# EAGLE design photoframe (EAGLE 9.2.1)
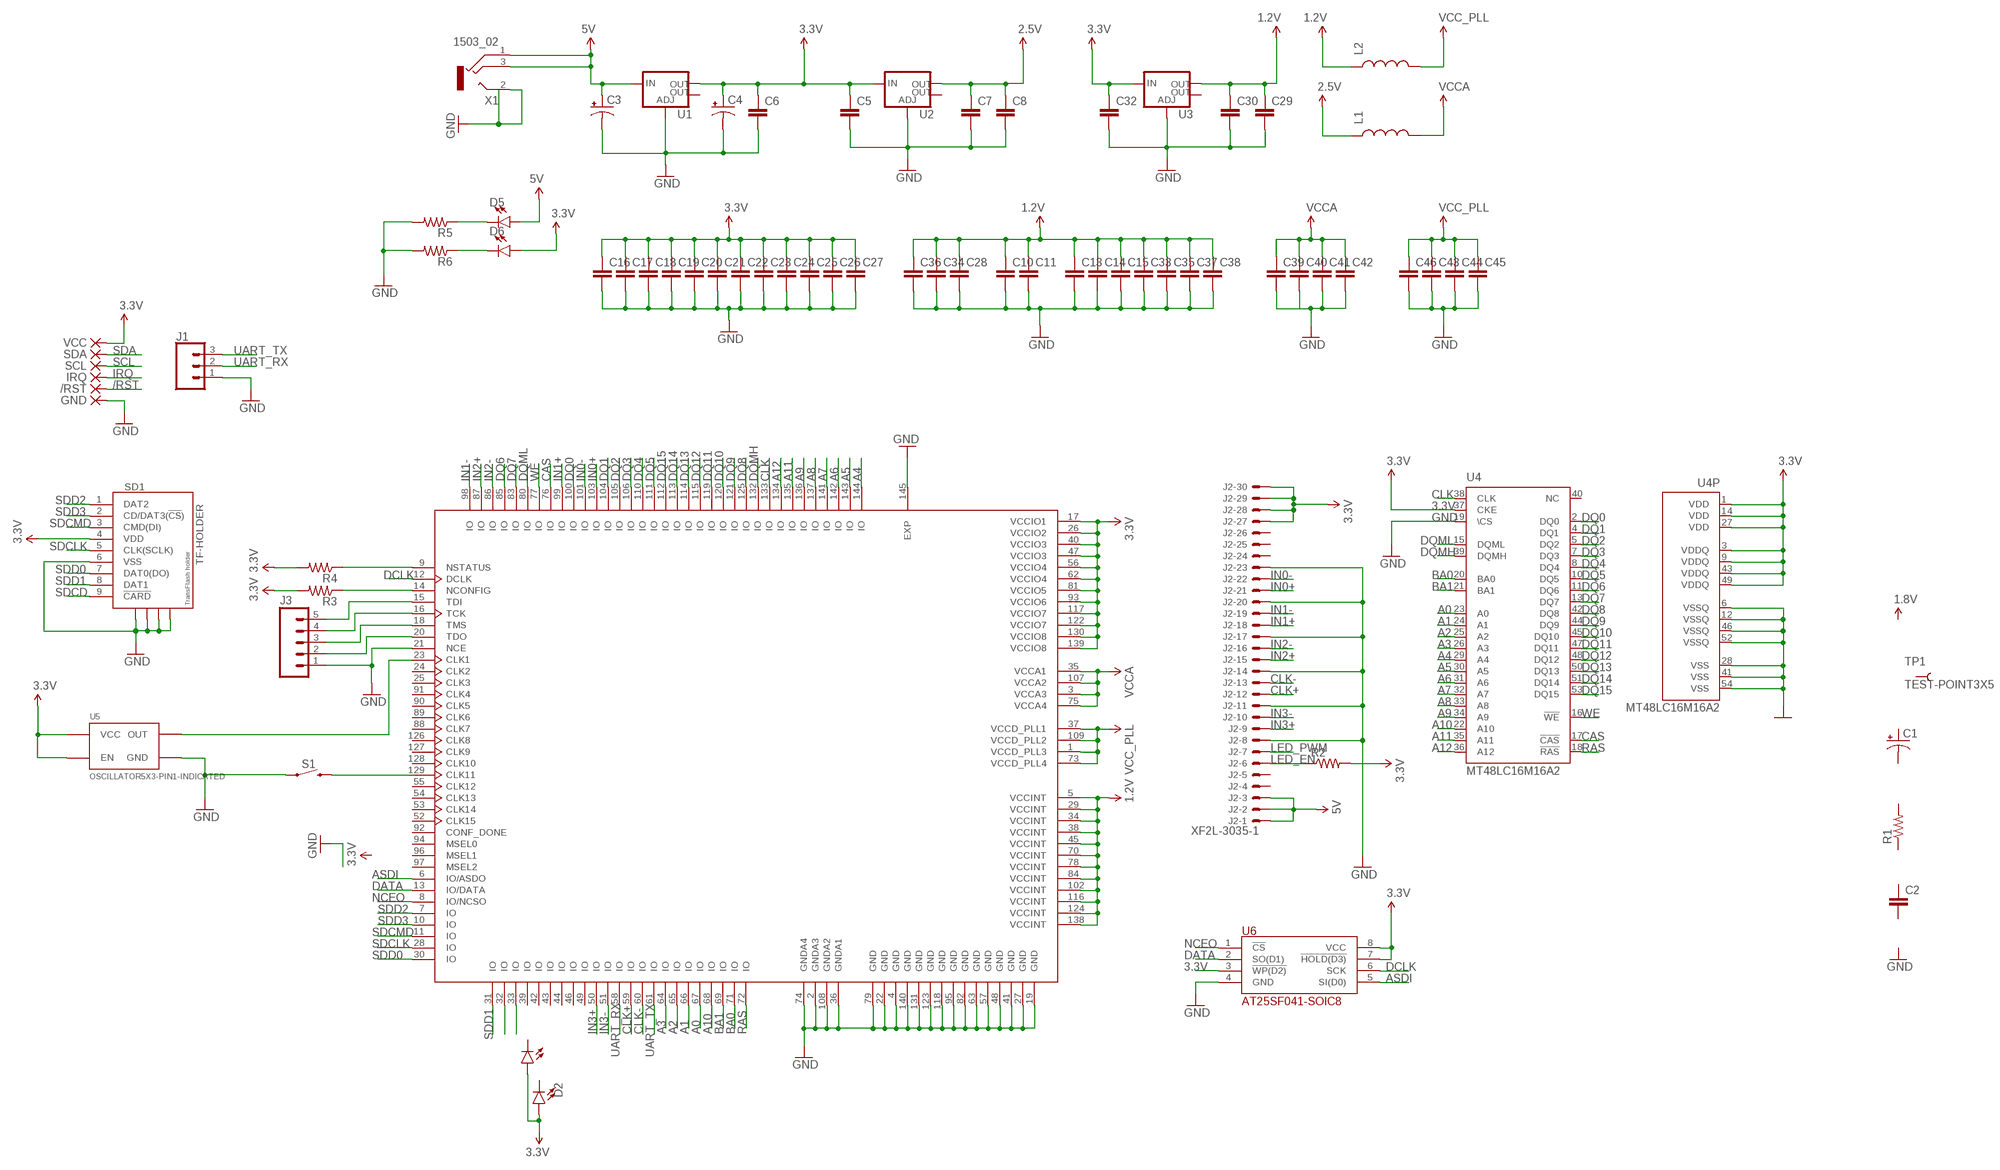
[diagram p0: schematic, sheet 1]

## Parts
/RST  PAD-SMD15R  [SMD15R]
C1  CAP_POL1206-KIT  [EIA3216-KIT]
C2  CAP0603-CAP  [0603-CAP]
C3  CAP_POL1206-KIT  [EIA3216-KIT]
C4  CAP_POL1206-KIT  [EIA3216-KIT]
C5  CAP1206  [1206]
C6  CAP0805  [0805]
C7  CAP1206  [1206]
C8  CAP0603-CAP  [0603-CAP]
C10  CAP0402-CAP  [0402-CAP]
C11  CAP0402-CAP  [0402-CAP]
C13  CAP0402-CAP  [0402-CAP]
C14  CAP0402-CAP  [0402-CAP]
C15  CAP0402-CAP  [0402-CAP]
C16  CAP0402-CAP  [0402-CAP]
C17  CAP0402-CAP  [0402-CAP]
C18  CAP0402-CAP  [0402-CAP]
C19  CAP0402-CAP  [0402-CAP]
C20  CAP0402-CAP  [0402-CAP]
C21  CAP0402-CAP  [0402-CAP]
C22  CAP0402-CAP  [0402-CAP]
C23  CAP0402-CAP  [0402-CAP]
C24  CAP0402-CAP  [0402-CAP]
C25  CAP0402-CAP  [0402-CAP]
C26  CAP0402-CAP  [0402-CAP]
C27  CAP0402-CAP  [0402-CAP]
C28  CAP0402-CAP  [0402-CAP]
C29  CAP0805  [0805]
C30  CAP1206  [1206]
C32  CAP1206  [1206]
C33  CAP0402-CAP  [0402-CAP]
C34  CAP0402-CAP  [0402-CAP]
C35  CAP0402-CAP  [0402-CAP]
C36  CAP0402-CAP  [0402-CAP]
C37  CAP0402-CAP  [0402-CAP]
C38  CAP0402-CAP  [0402-CAP]
C39  CAP0402-CAP  [0402-CAP]
C40  CAP0402-CAP  [0402-CAP]
C41  CAP0402-CAP  [0402-CAP]
C42  CAP0402-CAP  [0402-CAP]
C43  CAP0402-CAP  [0402-CAP]
C44  CAP0402-CAP  [0402-CAP]
C45  CAP0805  [0805]
C46  CAP0402-CAP  [0402-CAP]
D1  LED0603  [LED-0603]
D2  LED0603  [LED-0603]
D5  LED1206  [LED-1206]
D6  LED1206  [LED-1206]
GND  PAD-SMD14R  [SMD14R]
IRQ  PAD-SMD15R  [SMD15R]
J1  CONN_03LONGPADS  [1X03_LONGPADS]
J2  XF2L-3035-1  [XF2L-3035-1]
J3  M05PTH_LONGPADS  [1X05_LONGPADS]
L1  INDUCTOR0805-IND  [0805]
L2  INDUCTOR0805-IND  [0805]
R1  RESISTOR0603-RES  [0603-RES]
R2  RESISTOR0402-RES  [0402-RES]
R3  RESISTOR0402-RES  [0402-RES]
R4  RESISTOR0402-RES  [0402-RES]
R5  RESISTOR0603-RES  [0603-RES]
R6  RESISTOR0603-RES  [0603-RES]
S1  MOMENTARY-SWITCH-SPST-SMD-5.2-TALL-REDUNDANT  [TACTILE_SWITCH_SMD_5.2MM]
SCL  PAD-SMD15R  [SMD15R]
SD1  TF-HOLDER  [TF-PULL]
SDA  PAD-SMD15R  [SMD15R]
TP1  TEST-POINT3X5  [PAD.03X.05]
U0  EP4CE15E22  [QFP50P2200X2200X165-145N]
U1  V_REG_LM1117SOT223  [SOT223]
U2  V_REG_LM1117SOT223  [SOT223]
U3  V_REG_LM1117SOT223  [SOT223]
U4  MT48LC16M16A2  [TSOP54-400]
U5  OSCILLATOR5X3-PIN1-INDICATED  [CRYSTAL-OSC-SMD-5X3]
U6  AT25SF041-SOIC8  AT25SF041  [SO08]
VCC  PAD-SMD15R  [SMD15R]
X1  1503_02  [1503_02]

## Nets
1.0V: C10.1 C11.1 C13.1 C14.1 C15.1 C28.1 C29.1 C30.1 C33.1 C34.1 C35.1 C36.1 C37.1 C38.1 L2.1 U0.5(VCCINT) U0.29(VCCINT) U0.34(VCCINT) U0.38(VCCINT) U0.45(VCCINT) U0.70(VCCINT) U0.78(VCCINT) U0.84(VCCINT) U0.102(VCCINT) U0.116(VCCINT) U0.124(VCCINT) U0.138(VCCINT) U3.2(OUT) ; supply symbol labelled 1.2V
2.5V: C7.1 C8.1 L1.1 U2.2(OUT)
3.3V: C4.A(+) C5.1 C6.1 C16.1 C17.1 C18.1 C19.1 C20.1 C21.1 C22.1 C23.1 C24.1 C25.1 C26.1 C27.1 C32.1 D1.A D2.A D6.A J2.27 J2.28 J2.29 J2.30 R2.2 R3.2 R4.2 SD1.4(VDD) U0.17(VCCIO1) U0.26(VCCIO2) U0.40(VCCIO3) U0.47(VCCIO3) U0.56(VCCIO4) U0.62(VCCIO4) U0.81(VCCIO5) U0.93(VCCIO6) U0.117(VCCIO7) U0.122(VCCIO7) U0.130(VCCIO8) U0.139(VCCIO8) U1.2(OUT) U2.3(IN) U3.3(IN) U4.1(VDD) U4.3(VDDQ) U4.9(VDDQ) U4.14(VDD) U4.27(VDD) U4.37(CKE) U4.43(VDDQ) U4.49(VDDQ) U5.1(EN) U5.4(VCC) U6.3(!WP(D2)) U6.7(!HOLD(D3)) U6.8(VCC) VCC.PAD(P)
5V: C3.A(+) D5.A J2.1 J2.2 J2.3 U1.3(IN) X1.1 X1.3
/RST: /RST.PAD(P)
A0: U0.67(IO) U4.23(A0)
A1: U0.66(IO) U4.24(A1)
A2: U0.65(IO) U4.25(A2)
A3: U0.64(IO) U4.26(A3)
A4: U0.144(IO) U4.29(A4)
A5: U0.143(IO) U4.30(A5)
A6: U0.142(IO) U4.31(A6)
A7: U0.141(IO) U4.32(A7)
A8: U0.137(IO) U4.33(A8)
A9: U0.136(IO) U4.34(A9)
A10: U0.68(IO) U4.22(A10)
A11: U0.135(IO) U4.35(A11)
A12: U0.134(IO) U4.36(A12)
ASDI: U0.6(IO/ASDO) U6.5(SI(D0))
BA0: U0.71(IO) U4.20(BA0)
BA1: U0.69(IO) U4.21(BA1)
CAS: U0.76(IO) U4.17(!CAS)
CLK: U0.133(IO) U4.38(CLK)
CLK+: J2.12 U0.59(IO)
CLK-: J2.13 U0.60(IO)
DATA: U0.13(IO/DATA) U6.2(SO(D1))
DCLK: U0.12(DCLK) U6.6(SCK)
DQ0: U0.100(IO) U4.2(DQ0)
DQ1: U0.104(IO) U4.4(DQ1)
DQ2: U0.105(IO) U4.5(DQ2)
DQ3: U0.106(IO) U4.7(DQ3)
DQ4: U0.110(IO) U4.8(DQ4)
DQ5: U0.111(IO) U4.10(DQ5)
DQ6: U0.85(IO) U4.11(DQ6)
DQ7: U0.83(IO) U4.13(DQ7)
DQ8: U0.125(IO) U4.42(DQ8)
DQ9: U0.121(IO) U4.44(DQ9)
DQ10: U0.120(IO) U4.45(DQ10)
DQ11: U0.119(IO) U4.47(DQ11)
DQ12: U0.115(IO) U4.48(DQ12)
DQ13: U0.114(IO) U4.50(DQ13)
DQ14: U0.113(IO) U4.51(DQ14)
DQ15: U0.112(IO) U4.53(DQ15)
DQMH: U0.132(IO) U4.39(DQMH)
DQML: U0.80(IO) U4.15(DQML)
GND: C3.C(-) C4.C(-) C5.2 C6.2 C7.2 C8.2 C10.2 C11.2 C13.2 C14.2 C15.2 C16.2 C17.2 C18.2 C19.2 C20.2 C21.2 C22.2 C23.2 C24.2 C25.2 C26.2 C27.2 C28.2 C29.2 C30.2 C32.2 C33.2 C34.2 C35.2 C36.2 C37.2 C38.2 C39.2 C40.2 C41.2 C42.2 C43.2 C44.2 C45.2 C46.2 GND.PAD(P) J1.1 J2.8 J2.11 J2.14 J2.17 J2.20 J2.23 J3.1 R5.2 R6.2 S1.1 S1.2 SD1.6(VSS) SD1.S1 SD1.S2 SD1.S3 SD1.S4 U0.2(GNDA3) U0.4(GND) U0.19(GND) U0.21(NCE) U0.22(GND) U0.27(GND) U0.36(GNDA1) U0.41(GND) U0.48(GND) U0.57(GND) U0.63(GND) U0.74(GNDA4) U0.79(GND) U0.82(GND) U0.95(GND) U0.108(GNDA2) U0.118(GND) U0.123(GND) U0.131(GND) U0.140(GND) U0.145(EXP) U1.1(ADJ) U2.1(ADJ) U3.1(ADJ) U4.6(VSSQ) U4.12(VSSQ) U4.19(\CS) U4.28(VSS) U4.41(VSS) U4.46(VSSQ) U4.52(VSSQ) U4.54(VSS) U5.2(GND) U6.4(GND) X1.2 X1.2@2
IN0+: J2.21 U0.103(IO)
IN0-: J2.22 U0.101(IO)
IN1+: J2.18 U0.99(IO)
IN1-: J2.19 U0.98(IO)
IN2+: J2.15 U0.87(IO)
IN2-: J2.16 U0.86(IO)
IN3+: J2.9 U0.50(IO)
IN3-: J2.10 U0.51(IO)
IRQ: IRQ.PAD(P)
LED_EN: J2.6 R2.1
LED_PWM: J2.7
N$1: R4.1 U0.9(NSTATUS)
N$2: R3.1 U0.14(NCONFIG)
N$3: J3.2 U0.20(TDO)
N$4: J3.3 U0.18(TMS)
N$5: J3.4 U0.16(TCK)
N$6: U0.23(CLK1) U5.3(OUT)
N$7: J3.5 U0.15(TDI)
N$8: D5.C R5.1
N$9: D6.C R6.1
N$10: S1.3 S1.4 U0.129(CLK11)
N$16: U0.32(IO)
N$17: U0.33(IO)
NCEO: U0.8(IO/NCSO) U6.1(!CS)
RAS: U0.72(IO) U4.18(!RAS)
SCL: SCL.PAD(P)
SDA: SDA.PAD(P)
SDCD: SD1.9(!CARD)
SDCLK: SD1.5(CLK(SCLK)) U0.28(IO)
SDCMD: SD1.3(CMD(DI)) U0.11(IO)
SDD0: SD1.7(DAT0(DO)) U0.30(IO)
SDD1: SD1.8(DAT1) U0.31(IO)
SDD2: SD1.1(DAT2) U0.7(IO)
SDD3: SD1.2(CD/DAT3(!CS!)) U0.10(IO)
UART_RX: J1.2 U0.58(IO)
UART_TX: J1.3 U0.61(IO)
VCC_PLL: C43.1 C44.1 C45.1 C46.1 L2.2 U0.1(VCCD_PLL3) U0.37(VCCD_PLL1) U0.73(VCCD_PLL4) U0.109(VCCD_PLL2)
VCCA: C39.1 C40.1 C41.1 C42.1 L1.2 U0.3(VCCA3) U0.35(VCCA1) U0.75(VCCA4) U0.107(VCCA2)
WE: U0.77(IO) U4.16(!WE)
Unconnected: C1.A(+) C1.C(-) C2.1 C2.2 D1.C D2.C J2.4 J2.5 J2.24 J2.25 J2.26 R1.1 R1.2 TP1.P$1 U0.24(CLK2) U0.25(CLK3) U0.39(IO) U0.42(IO) U0.43(IO) U0.44(IO) U0.46(IO) U0.49(IO) U0.52(CLK15) U0.53(CLK14) U0.54(CLK13) U0.55(CLK12) U0.88(CLK7) U0.89(CLK6) U0.90(CLK5) U0.91(CLK4) U0.92(CONF_DONE) U0.94(MSEL0) U0.96(MSEL1) U0.97(MSEL2) U0.126(CLK8) U0.127(CLK9) U0.128(CLK10) U1.4(OUT) U2.4(OUT) U3.4(OUT) U4.40(NC)

## Library data of the parts
/RST GND IRQ SCL SDA VCC = dpads:PAD: WIRE PAD Standard US Drill Sizes and SMD pads
C1 C3 C4 = SparkFun-Passives:CAP_POL: Capacitor Polarized These are standard SMD and PTH capacitors. Normally 10uF, 47uF, and 100uF in electrolytic and tantalum varieties. Always verify the external diameter of the through hole cap, it varies with capacity, voltage, and manufacturer. The EIA devices should be standard.
C2 C5-C8 C10 C11 C13-C30 C32-C46 = SparkFun-Passives:CAP: Capacitor Standard 0603 ceramic capacitor, and 0.1" leaded capacitor.
D1 D2 D5 D6 = SparkFun-LED:LED: LED (Generic) Standard schematic elements and footprints for 5mm, 3mm, 1206, and 0603 sized LEDs. Generic LEDs with no color specified.
J1 = SparkFun-Connectors:CONN_03: Multi connection point. Often used as Generic Header-pin footprint for 0.1 inch spaced/style header connections On any of the 0.1 inch spaced packages, you can populate with these: Break Away Headers - Straight <https://www.sparkfun.com/products/116> (PRT-00116) Break Away Male Headers - Right Angle <https://www.sparkfun.com/products/553> (PRT-00553) Female Headers <https://www.sparkfun.com/products/115> (PRT-00115) Break Away Headers - Machine Pin <https://www.sparkfun.com/products/117> (PRT-00117) Break Away Female Headers - Swiss Machine Pin <https://www.sparkfun.com/products/743> (PRT-00743) Stackable Header - 3 Pin (Female, 0.1") <https://www.sparkfun.com/products/13875> (PRT-13875) For SCREWTERMINALS and SPRING TERMINALS visit here: Screw Terimnals on SparkFun.com <https://www.sparkfun.com/search/results?term=Screw+Terminals> (5mm/3.5mm/2.54mm spacing) This device is also useful as a general connection point to wire up your design to another part of your project. Our various solder wires solder well into these plated through hole pads. Hook-Up Wire - Assortment (Stranded, 22 AWG) <https://www.sparkfun.com/products/11375> (PRT-11375) Hook-Up Wire - Assortment (Solid Core, 22 AWG) <https://www.sparkfun.com/products/11367> (PRT-11367) View the entire wire category on our website here <https://www.sparkfun.com/categories/141> Special notes: Molex polarized connector foot print use with SKU : PRT-08232 with associated crimp pins and housings.
J2 = con-omron:XF2*-30?: OMRON FPC Connector Source : http://www.omron.com/ecb/products/pdf/fpc.pdf; MPN: XF2L-3035-1A; OC_FARNELL: 1430931; OC_NEWARK: 05M2008
J3 = SparkFun-Connectors:M05: Header 5 Standard 5-pin 0.1" header. Use with straight break away headers (SKU : PRT-00116), right angle break away headers (PRT-00553), swiss pins (PRT-00743), machine pins (PRT-00117), and female headers (PRT-00115). Molex polarized connector foot print use with SKU : PRT-08230 with associated crimp pins and housings.
L1 L2 = SparkFun-Passives:INDUCTOR: Inductors Basic Inductor/Choke - 0603 and 1206. Footprints are not proven and vary greatly between part numbers. INDUCTOR POWER 3.3UH 4.0A SMD 0.197" L x 0.197" W x 0.177" H (5.00mm x 5.00mm x 4.50mm); PROD_ID: NDUC-13076
R1-R6 = SparkFun-Passives:RESISTOR: Resistor Basic schematic elements and footprints for 0603, 1206, and PTH resistors.
S1 = SparkFun-Switches:MOMENTARY-SWITCH-SPST: Momentary Switch (Pushbutton) - SPST Normally-open (NO) SPST momentary switches (buttons, pushbuttons). Variants PTH-12MM - 12mm square, through-hole Momentary Pushbutton Switch - 12mm Square <https://www.sparkfun.com/products/9190> (COM-09190) PTH-6.0MM, PTH-6.0MM-KIT - 6.0mm square, through-hole Mini Pushbutton Switch <https://www.sparkfun.com/products/97> (COM-00097) KIT package intended for soldering kit's - only one side of pads' copper is exposed. PTH-RIGHT-ANGLE-KIT - Right-angle, through-hole Right Angle Tactile Button <https://www.sparkfun.com/products/10791> - Used on SparkFun BigTime Watch Kit <https://www.sparkfun.com/products/11734> SMD-12MM - 12mm square, surface-mount Tactile Button - SMD (12mm) <https://www.sparkfun.com/products/12993> (COM-12993) Used on SparkFun PicoBoard <https://www.sparkfun.com/products/11888> SMD-4.5MM - 4.5mm Square Trackball Switch Used on SparkFun Blackberry Trackballer Breakout <https://www.sparkfun.com/products/13169> SMD-4.6MMX2.8MM - 4.60mm x 2.80mm, surface mount Used on SparkFun SAMD21 Mini Breakout <https://www.sparkfun.com/products/13664> SMD-5.2MM, SMD-5.2-REDUNDANT - 5.2mm square, surface-mount Mini Pushbutton Switch - SMD <https://www.sparkfun.com/products/8720> (COM-08720) Used on Arduino Pro Mini <https://www.sparkfun.com/products/11114> REDUNDANT package connects both switch circuits together SMD-6.0X3.5MM - 6.0 x 3.5mm, surface mount Momentary Reset Switch SMD <https://www.sparkfun.com/products/8229> (COM-08229) SMD-6.2MM-TALL - 6.2mm square, surface mount Tactile Button - SMD (6mm) <https://www.sparkfun.com/products/12992> Used on SparkFun Digital Sandbox <https://www.sparkfun.com/products/12651> SMD-RIGHT-ANGLE - Right-angle, surface mount Used on SparkFun Block for Intel® Edison - Arduino <https://www.sparkfun.com/products/13036>; PROD_ID: SWCH-14139
SD1 = sd-mmc:TF-HOLDER: TF / Micro SD socket is PUSH-PUSH type, the card can be pushed into and auto locked and pushed out by simply press the card. Surface Mounting type.
TP1 = SparkFun-Passives:TEST-POINT: Bare copper test points for troubleshooting or ICT
U0 = EP4CE6E22C8N:EP4CE15E22
U1-U3 = SparkFun-PowerIC:V_REG_LM1117: Voltage Regulator LM1117 Standard adjustable voltage regulator but in SMD form. Spark Fun Electronics SKU : COM-00595; PROD_ID: VREG-08170
U4 = memory-micron:MT48LC16M16A2: 256Mb: x16 SDRAM MT48LC16M16A2 - 4 Meg x 16 x 4 banks Source: http://download.micron.com/pdf/datasheets/dram/sdram/256MSDRAM.pdf; OC_FARNELL: unknown; OC_NEWARK: unknown
U5 = SparkFun-FreqCtrl:OSCILLATOR: Generic 5x3 and 7x5 oscillators
U6 = SparkFun-DigitalIC:AT25SF041: SPI Serial flash memory with dual/quad-IO support; PROD_ID: IC-12455
X1 = con-lumberg:1503_02: Jack connectors according to JISC 6560, 3.5 mm Klinkeneinbaukupplung nach JISC 6560, 3,5 mm, 3-polig/stereo, abgewinkelte Ausführung, Surface-Mount-Technik (SMT) Source: http://www.lumberg.com/Produkte/PDFs/1503_02.pdf; OC_FARNELL: 1216979; OC_NEWARK: unknown

## Board
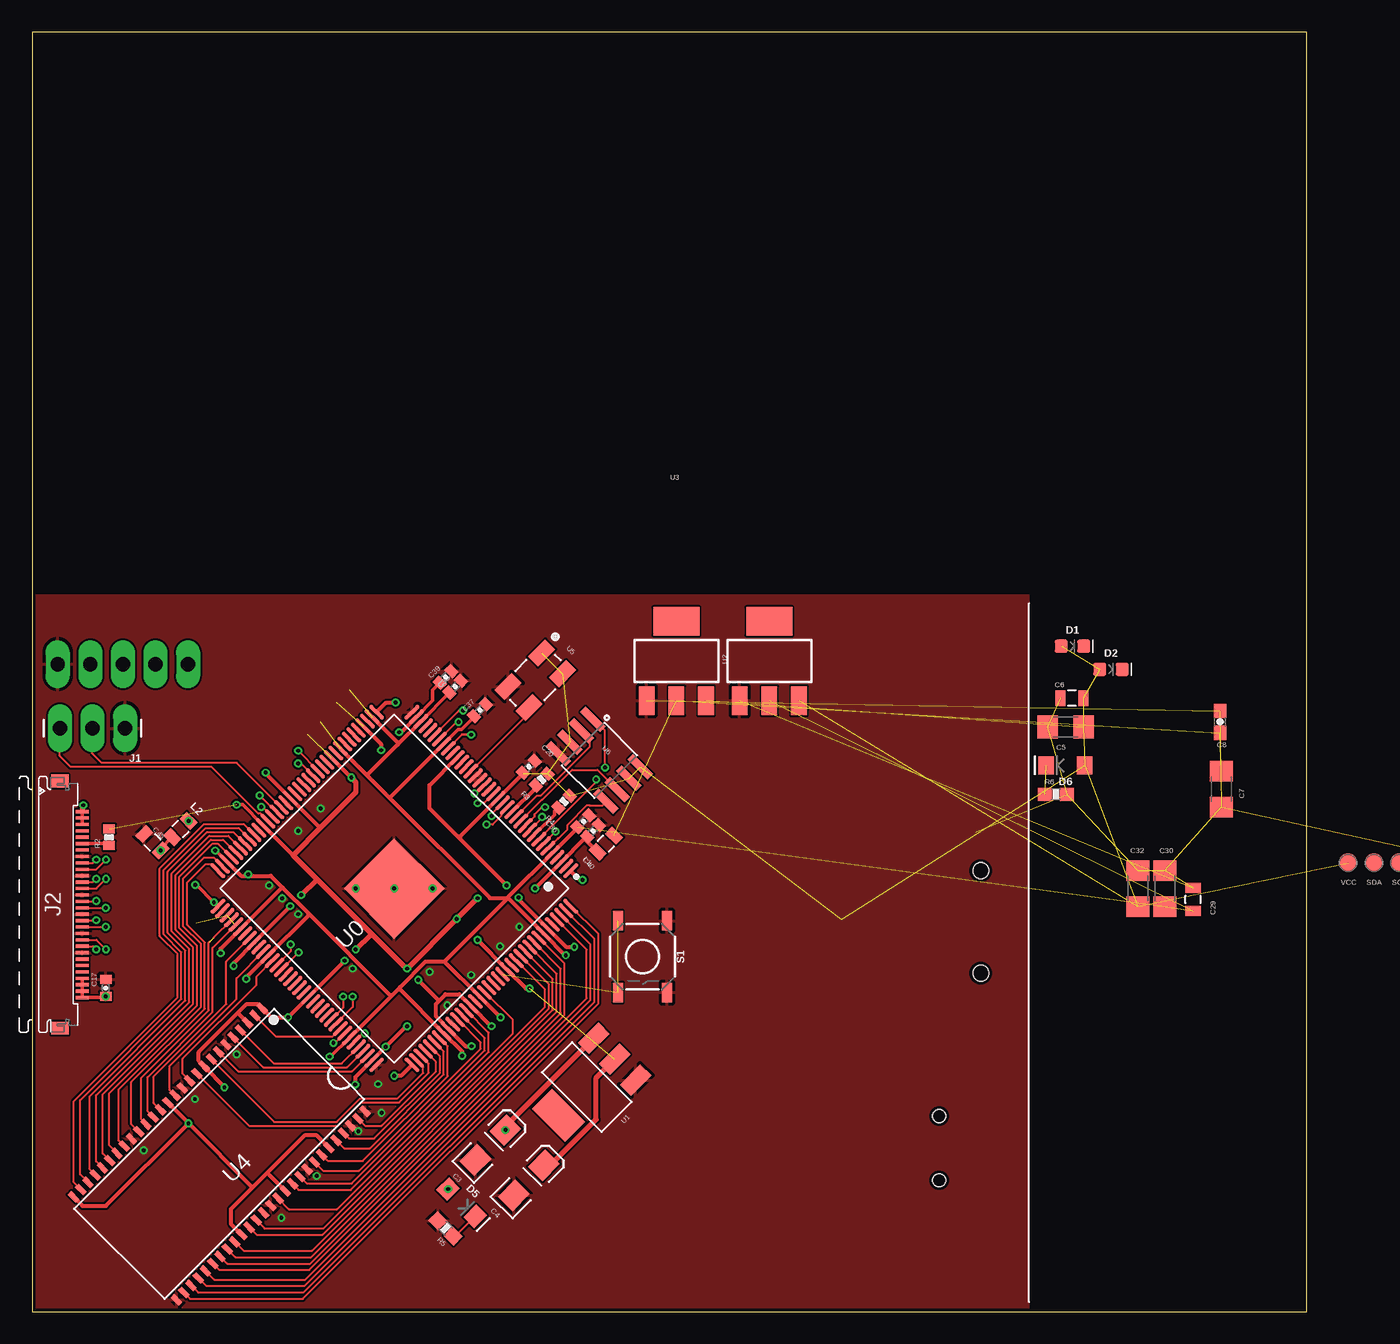
[diagram p1: board, top side]
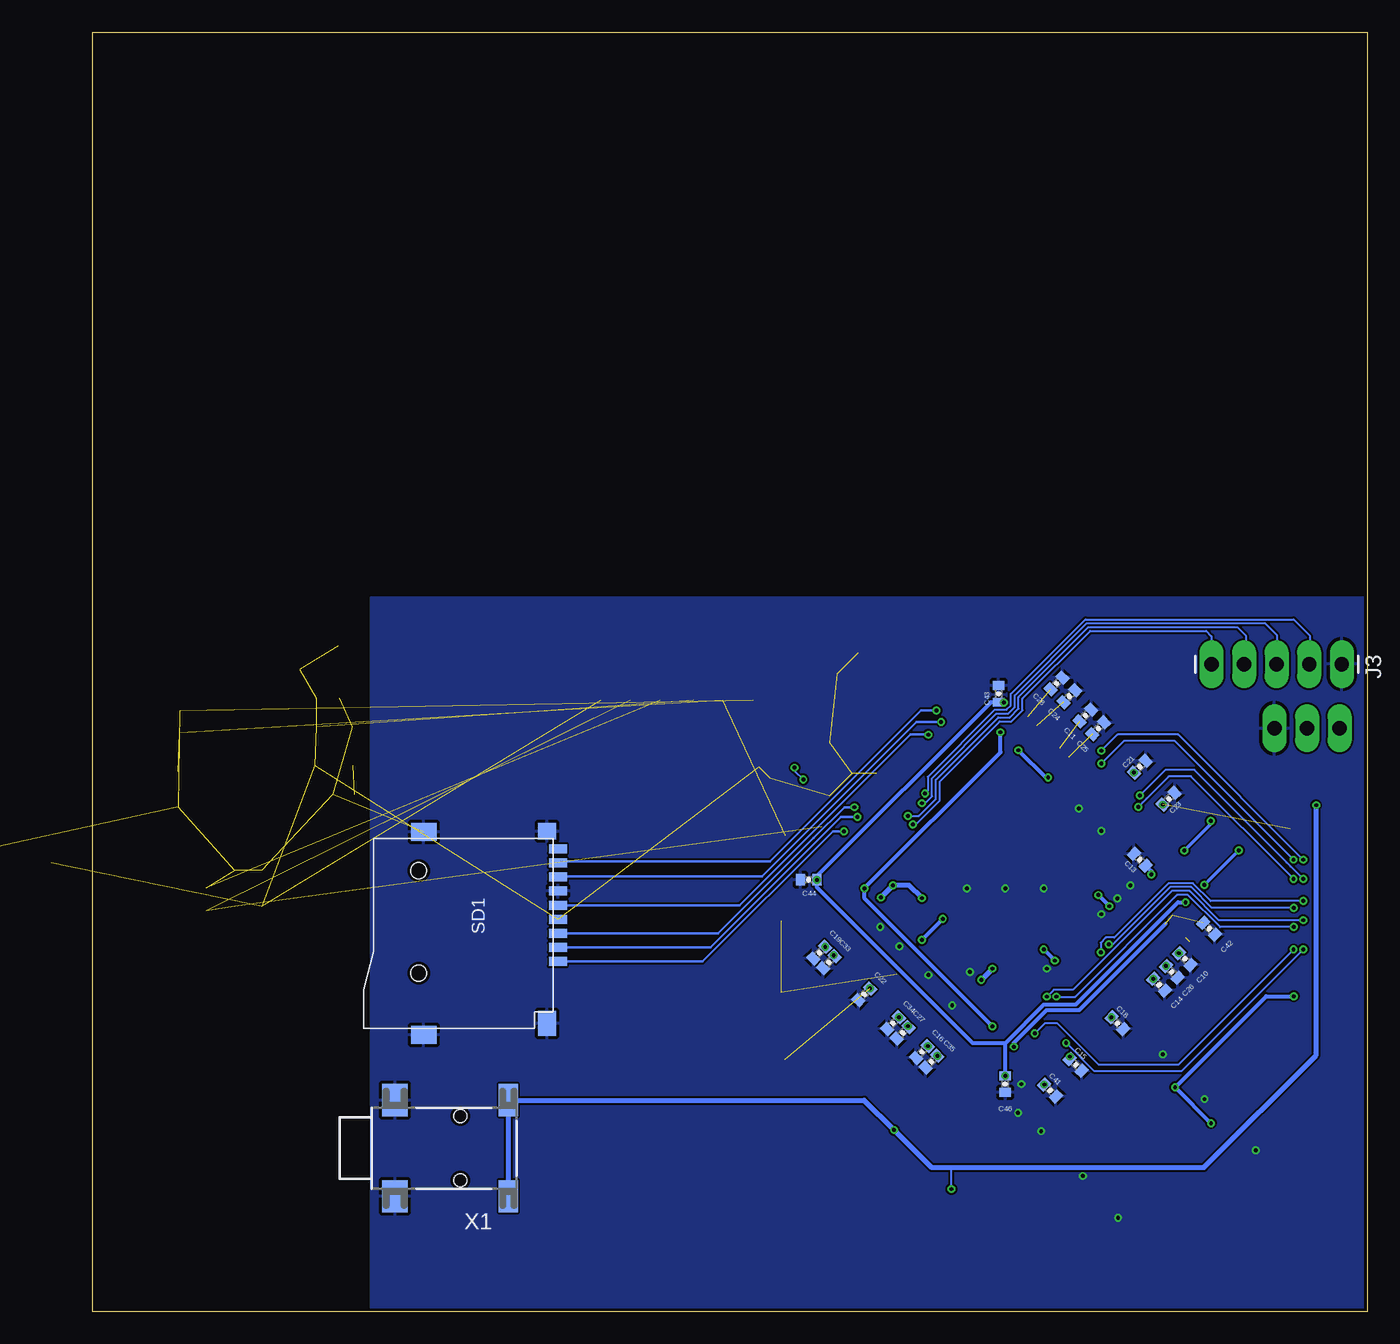
[diagram p2: board, bottom side, seen from below]

Size 99.4 x 99.8 mm. Coordinates in mm from the lower left corner, seen from the top.
Outline: 0,0 99.4,0 99.4,99.8 0,99.8 0,0
Copper layers (1*16): Top 0.035mm / dielectric 1.5mm / Bottom 0.035mm
Design rules "SeeedStudio_2layer_DRU_no_angle_20140221": minimum track width 6mil, minimum drill 12mil, track to track 6mil, track to pad 6mil, pad to pad 6mil, via to via 6mil, smd to smd 0mil, copper to edge 10mil, drill to drill 10mil, minimum pad ring 10mil, minimum via ring 6mil, stop-mask expansion 2mil, vias tented up to drill 100mil, thermal gap 10mil

### Footprints (pad centres in the part's own frame; a part is rotated, then mirrored left to right if it is on the bottom)
SMD15R = smd 1.5 x 1.5: PAD 0,0
EIA3216-KIT = smd 1.9 x 1.6: A 1.65,0; C -1.65,0
0603-CAP = smd 1.1 x 1: 1 -0.85,0; 2 0.85,0
1206 = smd 1.6 x 1.8: 1 -1.4,0; 2 1.4,0
0805 = smd 0.8 x 1.2: 1 -0.9,0; 2 0.9,0
0402-CAP = smd 0.7 x 0.9: 1 -0.65,0; 2 0.65,0
LED-0603 = smd 1 x 1: A -0.877,0; C 0.877,0
LED-1206 = smd 1.2 x 1.4: A -1.5,0; C 1.5,0
SMD14R = smd 1.4 x 1.4: PAD 0,0
1X03_LONGPADS = drill 1.118 pad 1.88 long: 1 0,0; 2 2.54,0; 3 5.08,0
XF2L-3035-1 = smd 1 x 0.25: 1 1.905,7.25; 2 1.905,6.75; 3 1.905,6.25; 4 1.905,5.75; 5 1.905,5.25; 6 1.905,4.75; 7 1.905,4.25; 8 1.905,3.75; 9 1.905,3.25; 10 1.905,2.75; 11 1.905,2.25; 12 1.905,1.75; 13 1.905,1.25; 14 1.905,0.75; 15 1.905,0.25; 16 1.905,-0.25; 17 1.905,-0.75; 18 1.905,-1.25; 19 1.905,-1.75; 20 1.905,-2.25; 21 1.905,-2.75; 22 1.905,-3.25; 23 1.905,-3.75; 24 1.905,-4.25; 25 1.905,-4.75; 26 1.905,-5.25; 27 1.905,-5.75; 28 1.905,-6.25; 29 1.905,-6.75; 30 1.905,-7.25 | smd 1.34 x 1: M1 0.18,9.637; M2 0.18,-9.637
1X05_LONGPADS = drill 1.118 pad 1.88 long: 1 0,0; 2 2.54,0; 3 5.08,0; 4 7.62,0; 5 10.16,0
0603-RES = smd 1.1 x 1: 1 -0.85,0; 2 0.85,0
0402-RES = smd 0.7 x 0.9: 1 -0.65,0; 2 0.65,0
TACTILE_SWITCH_SMD_5.2MM = smd 1.524 x 0.762: 1 -2.794,1.905; 2 2.794,1.905; 3 -2.794,-1.905; 4 2.794,-1.905
TF-PULL = smd 0.7 x 1.4: 1 -2.2,-7.62; 2 -1.1,-7.62; 3 0,-7.62; 4 1.1,-7.62; 5 2.2,-7.62; 6 3.3,-7.62; 7 4.4,-7.62; 8 5.5,-7.62; 9 6.6,-7.62 | smd 1.4 x 2: S1 -7.9,2.85; S2 7.9,2.85 | smd 1.28 x 1.4: S3 7.96,-6.75 | smd 1.95 x 1.4: S4 -7.025,-6.75 | hole 1.25: -3.1,3.25; 4.9,3.25
PAD.03X.05 = smd 1.27 x 1.27: P$1 0,0
QFP50P2200X2200X165-145N = smd 1.5 x 0.3: 1 -10.7,8.75; 2 -10.7,8.25; 3 -10.7,7.75; 4 -10.7,7.25; 5 -10.7,6.75; 6 -10.7,6.25; 7 -10.7,5.75; 8 -10.7,5.25; 9 -10.7,4.75; 10 -10.7,4.25; 11 -10.7,3.75; 12 -10.7,3.25; 13 -10.7,2.75; 14 -10.7,2.25; 15 -10.7,1.75; 16 -10.7,1.25; 17 -10.7,0.75; 18 -10.7,0.25; 19 -10.7,-0.25; 20 -10.7,-0.75; 21 -10.7,-1.25; 22 -10.7,-1.75; 23 -10.7,-2.25; 24 -10.7,-2.75; 25 -10.7,-3.25; 26 -10.7,-3.75; 27 -10.7,-4.25; 28 -10.7,-4.75; 29 -10.7,-5.25; 30 -10.7,-5.75; 31 -10.7,-6.25; 32 -10.7,-6.75; 33 -10.7,-7.25; 34 -10.7,-7.75; 35 -10.7,-8.25; 36 -10.7,-8.75; 73 10.7,-8.75; 74 10.7,-8.25; 75 10.7,-7.75; 76 10.7,-7.25; 77 10.7,-6.75; 78 10.7,-6.25; 79 10.7,-5.75; 80 10.7,-5.25; 81 10.7,-4.75; 82 10.7,-4.25; 83 10.7,-3.75; 84 10.7,-3.25; 85 10.7,-2.75; 86 10.7,-2.25; 87 10.7,-1.75; 88 10.7,-1.25; 89 10.7,-0.75; 90 10.7,-0.25; 91 10.7,0.25; 92 10.7,0.75; 93 10.7,1.25; 94 10.7,1.75; 95 10.7,2.25; 96 10.7,2.75; 97 10.7,3.25; 98 10.7,3.75; 99 10.7,4.25; 100 10.7,4.75; 101 10.7,5.25; 102 10.7,5.75; 103 10.7,6.25; 104 10.7,6.75; 105 10.7,7.25; 106 10.7,7.75; 107 10.7,8.25; 108 10.7,8.75 | smd 0.3 x 1.5: 37 -8.75,-10.7; 38 -8.25,-10.7; 39 -7.75,-10.7; 40 -7.25,-10.7; 41 -6.75,-10.7; 42 -6.25,-10.7; 43 -5.75,-10.7; 44 -5.25,-10.7; 45 -4.75,-10.7; 46 -4.25,-10.7; 47 -3.75,-10.7; 48 -3.25,-10.7; 49 -2.75,-10.7; 50 -2.25,-10.7; 51 -1.75,-10.7; 52 -1.25,-10.7; 53 -0.75,-10.7; 54 -0.25,-10.7; 55 0.25,-10.7; 56 0.75,-10.7; 57 1.25,-10.7; 58 1.75,-10.7; 59 2.25,-10.7; 60 2.75,-10.7; 61 3.25,-10.7; 62 3.75,-10.7; 63 4.25,-10.7; 64 4.75,-10.7; 65 5.25,-10.7; 66 5.75,-10.7; 67 6.25,-10.7; 68 6.75,-10.7; 69 7.25,-10.7; 70 7.75,-10.7; 71 8.25,-10.7; 72 8.75,-10.7; 109 8.75,10.7; 110 8.25,10.7; 111 7.75,10.7; 112 7.25,10.7; 113 6.75,10.7; 114 6.25,10.7; 115 5.75,10.7; 116 5.25,10.7; 117 4.75,10.7; 118 4.25,10.7; 119 3.75,10.7; 120 3.25,10.7; 121 2.75,10.7; 122 2.25,10.7; 123 1.75,10.7; 124 1.25,10.7; 125 0.75,10.7; 126 0.25,10.7; 127 -0.25,10.7; 128 -0.75,10.7; 129 -1.25,10.7; 130 -1.75,10.7; 131 -2.25,10.7; 132 -2.75,10.7; 133 -3.25,10.7; 134 -3.75,10.7; 135 -4.25,10.7; 136 -4.75,10.7; 137 -5.25,10.7; 138 -5.75,10.7; 139 -6.25,10.7; 140 -6.75,10.7; 141 -7.25,10.7; 142 -7.75,10.7; 143 -8.25,10.7; 144 -8.75,10.7 | smd 5.55 x 5.55: 145 0,0
SOT223 = smd 1.219 x 2.235: 1 -2.311,-3.099; 2 0,-3.099; 3 2.311,-3.099 | smd 3.6 x 2.2: 4 0,3.099
TSOP54-400 = smd 0.4 x 0.9: 1 -10.4,-5.68; 2 -9.6,-5.68; 3 -8.8,-5.68; 4 -8,-5.68; 5 -7.2,-5.68; 6 -6.4,-5.68; 7 -5.6,-5.68; 8 -4.8,-5.68; 9 -4,-5.68; 10 -3.2,-5.68; 11 -2.4,-5.68; 12 -1.6,-5.68; 13 -0.8,-5.68; 14 0,-5.68; 15 0.8,-5.68; 16 1.6,-5.68; 17 2.4,-5.68; 18 3.2,-5.68; 19 4,-5.68; 20 4.8,-5.68; 21 5.6,-5.68; 22 6.4,-5.68; 23 7.2,-5.68; 24 8,-5.68; 25 8.8,-5.68; 26 9.6,-5.68; 27 10.4,-5.68; 28 10.4,5.68; 29 9.6,5.68; 30 8.8,5.68; 31 8,5.68; 32 7.2,5.68; 33 6.4,5.68; 34 5.6,5.68; 35 4.8,5.68; 36 4,5.68; 37 3.2,5.68; 38 2.4,5.68; 39 1.6,5.68; 40 0.8,5.68; 41 0,5.68; 42 -0.8,5.68; 43 -1.6,5.68; 44 -2.4,5.68; 45 -3.2,5.68; 46 -4,5.68; 47 -4.8,5.68; 48 -5.6,5.68; 49 -6.4,5.68; 50 -7.2,5.68; 51 -8,5.68; 52 -8.8,5.68; 53 -9.6,5.68; 54 -10.4,5.68
CRYSTAL-OSC-SMD-5X3 = smd 1.9 x 1.1: 1 -1.85,-1.15; 2 1.85,-1.15; 3 1.85,1.15; 4 -1.85,1.15
SO08 = smd 0.61 x 2.21: 1 -1.905,-2.616; 2 -0.635,-2.616; 3 0.635,-2.616; 4 1.905,-2.616; 5 1.905,2.616; 6 0.635,2.616; 7 -0.635,2.616; 8 -1.905,2.616
1503_02 = smd 2.5 x 1.5: 1 -3.75,-10.75; 3 3.75,-10.75 | smd 2.5 x 2: 2 -3.75,-1.9; 2@2 3.75,-1.9 | hole 1: -2.5,-7; 2.5,-7

### Placement (x,y rotation side)
/RST  108.65,35 0 top  (outside the outline)
C1  -27.94,58.42 0 top  (outside the outline)
C2  -63.5,58.42 0 top  (outside the outline)
C3  35.75,13 45 top
C4  38.75,10.25 45 top
C5  80.6,45.6 180 top
C6  81.1,47.85 180 top
C7  92.75,40.75 270 top
C8  92.65,46 90 top
C10  14.25,27.5 315 bottom
C11  22,46.5 45 bottom
C13  17.75,35.25 135 bottom
C14  16.25,25.5 315 bottom
C15  22.75,19.25 315 bottom
C16  34.75,20.25 225 bottom
C17  5.75,25.25 90 top
C18  19.5,22.5 315 bottom
C19  42.75,28 225 bottom
C20  38.75,42.5 45 top
C21  17.75,42.5 45 bottom
C22  39.25,24.75 225 bottom
C23  15.5,40 45 bottom
C24  23.25,48 45 bottom
C25  21,45.5 45 bottom
C26  15.25,26.5 315 bottom
C27  36.25,21.75 225 bottom
C28  24.25,49 45 bottom
C29  90.55,32.15 90 top
C30  88.35,33 90 top
C32  86.25,33 90 top
C33  42,27.25 225 bottom
C34  37,22.5 225 bottom
C35  34,19.5 225 bottom
C36  43,38.25 45 top
C37  34.93,46.91 45 top
C38  33,48.75 45 top
C39  32.25,49.5 45 top
C40  43.75,37.5 45 top
C41  24.75,17.25 315 bottom
C42  12.35,29.87 315 bottom
C43  28.77,48.18 90 bottom
C44  43.58,33.68 180 bottom
C45  9.39,36.61 135 top
C46  28.25,17.75 270 bottom
D1  81.15,51.9 0 top
D2  84.15,50.1 0 top
D5  33.5,8.5 315 top
D6  80.6,42.6 180 top
GND  112.65,35 0 top  (outside the outline)
IRQ  110.65,35 0 top  (outside the outline)
J1  7.25,45.5 180 top
J2  2,31.75 0 top
J3  2,50.5 180 bottom
L1  44.75,36.5 225 top
L2  11.57,37.64 225 top
R1  -30.48,63.5 0 top  (outside the outline)
R2  6,37 90 top
R3  39.75,41.5 45 top
R4  41.49,39.78 45 top
R5  32.25,6.5 135 top
R6  79.85,40.35 0 top
S1  47.61,27.69 270 top
SCL  106.65,35 0 top  (outside the outline)
SD1  70.75,29.5 90 bottom
SDA  104.65,35 0 top  (outside the outline)
TP1  -36.83,68.58 0 top  (outside the outline)
U0  28.25,33 225 top
U1  43.25,17.5 135 top
U2  50.25,50.75 0 top
U3  57.5,50.75 0 top
U4  14.6,12.29 225 top
U5  39.25,49.25 225 top
U6  44.25,43 225 top
VCC  102.65,35 0 top  (outside the outline)
X1  77.75,12.75 90 bottom

### Tracks (layer width: path | path; a pad name or v marks a point on that pad's centre or on a via)
1.0V  (via drill 0.3 pad 0.6)  (5 unrouted)
  Top 0.254: U0.102 23.27,19.89 v23.21,19.89 | U0.70 14.33,35.96 v14.28,35.96 | U0.34 32.54,48.25 C38.1 | 42.54,37.74 C36.1 | U0.29 33.24,45.42 33.49,45.42 34.47,46.39 C37.1
  Top 0.305: U0.45 26.11,41.86 | 26.11,41.86 27.86,40.11 | 27.86,40.11 35.72,32.25 37.13,32.25 | 37.13,32.25 U0.138 41.58,27.8 v41.63,27.8 | 37.13,32.25 37.13,32.34 U0.5 42.54,37.74 | U0.29 27.93,40.11 27.86,40.11 | U0.34 28.52,44.23 | 28.52,44.23 26.15,41.86 26.11,41.86 | U0.38 28.52,44.4 28.52,44.23 | 37.13,32.25 32.19,27.31 | 32.19,27.31 32.19,27.29 U0.124 36.52,22.96 C34.1 | U0.70 16.29,34 16.75,34 | 16.75,34 18.62,34 19.56,33.06 | U0.102 28.07,24.68 | 28.07,24.68 28.69,25.31 | 28.69,25.31 30.69,27.31 32.19,27.31 | 28.07,24.68 27.93,24.68 21.56,31.06 | 19.56,33.06 21.56,31.06 | 28.69,25.31 28.69,25.14 U0.116 33.54,20.29 C35.1 | 19.56,33.06 19.47,33.06 U0.78 14.71,28.3 C10.1 | 21.56,31.06 21.56,30.91 U0.84 16.71,26.06 C14.1 | v16.84,34.09 16.75,34
  Bottom 0.254: v14.28,35.96 12.21,38.03 L2.1
  Bottom 0.305: C13.1 16.84,34.34 v16.84,34.09 | C34.1 | v41.63,27.8 C33.1 | v23.21,19.89 C15.1
  other vias: 36.54,22.96 33.54,19.96 16.71,25.96 14.71,27.96 12.21,38.28
2.5V  (3 unrouted)
3.3V  (via drill 0.3 pad 0.6)  (21 unrouted)
  Top 0.254: C17.1 5.65,24.5 J2.30 J2.29 J2.28 J2.27 | U0.62 16.41,39.54 C23.1 | 38.29,41.98 C20.1
  Top 0.305: U0.62 20.35,35.6 | 29.2,26.75 v29.25,26.75 | U0.47 v24.9,41.65 | 20.35,35.6 | 22.5,37.75 22.44,37.75 U0.56 18.21,41.98 C21.1 | v37.95,32.29 37.95,32.14 U0.139 41.63,28.46 C19.1 | v37,33.25 33.38,36.88 | 33.38,36.88 31,39.25 31,41.05 U0.26 | 33.38,36.88 33.38,37.06 U0.17 38.29,41.98 | U0.40 27.21,44.29 v27.21,43.79 | 31.75,24.25 31.5,24 31.5,23.03 U0.117 33.82,20.71 C16.1 | 31.75,24.25 32.25,24.75 33.32,24.75 U0.122 35.8,22.27 v35.85,22.27 | v30.12,25.88 31.75,24.25 | v20.13,31.63 20.13,31.6 U0.81 15.71,27.18 C26.1 | v24.38,27.38 24.38,27.36 U0.93 19.98,22.96 C18.1 18.64,22.96 U4.1 17.6,24 16.75,24 16,23.25 | C22.1 38.52,25.21 U0.130 34.75,28.98 v34.75,29 | 16,23.25 13,20.25 13,19.55 U4.9 15,17.55 v15,17.5 | U4.3 16.09,23.25 16,23.25 | U4.49 22.2,13.75 21.25,13.75 18.38,10.88 | U4.37 15.5,6.87 15.5,8 17.25,9.75 | 18.38,10.88 17.25,9.75 | U4.43 18.38,10.78 18.38,10.88 | U4.14 v12.2,14.7 | v12.2,14.7 17.15,9.75 17.25,9.75 | U4.27 3.94,8.25 5.75,8.25 v12.2,14.7 | 22.22,33.72 | 26.47,29.47
  Top 0.406: 22.22,33.72 20.35,35.6 22.5,37.75 25.25,40.5 25.25,41.3 v24.9,41.65 | 22.22,33.72 26.47,29.47 | 26.47,29.47 29.2,26.75 | v20.99,32.49 22.22,33.72 | v25.25,28.25 26.47,29.47 | v29.25,26.75 v33.12,30.62 v34.75,32.25 | C4.A 40.42,11.42 44,15 44,18.25 U1.2 | U1.2
  Bottom 0.305: v37,33.24 v37,33.25 | v27.21,43.79 25.08,41.65 v24.9,41.65 | v20.13,31.63 v20.99,32.49 | v24.38,27.38 v25.25,28.25 | v35.85,22.27 C27.1 | C19.1 | v12.2,14.7 v15,17.5 7.9,24.6 C17.1 | v34.75,29 v33.12,30.62
  Bottom 0.406: v29.25,26.75 v30.12,25.88 | v37.95,32.29 v37,33.24 35.74,33.24 v34.75,32.25
  other vias: 38.79,25.21 42.29,28.46 34.29,20.71 19.96,22.96 15.71,26.96 5.75,24.6 15.96,39.54 18.21,42.04
5V  (via drill 0.3 pad 0.6)
  Top 0.254: J2.1 J2.2 J2.3
  Top 0.406: C3.A 37.25,14.5 37.25,14.75 43.81,21.31 U1.3 | v4,39.5 3.9,39.41 J2.1
  Bottom 0.152: 32.5,11.25 32.5,9.62 D5.A
  Bottom 0.406: v4,39.5 4,20 12.75,11.25 32.5,11.25 34,11.25 C3.A 39.25,16.5 X1.3 X1.1
  other vias: 36.92,14.17 32.44,9.56
A0
  Top 0.152: U4.23 5,11.71 5,16.88 12.26,24.14 12.26,28.29 10.88,29.66 10.88,34.18 13.82,37.11 15.3,37.11 U0.67
A1
  Top 0.152: U4.24 4.5,11.08 4.5,16.81 11.95,24.26 11.95,28.16 10.58,29.53 10.58,34.33 13.66,37.41 15.7,37.41 U0.66
A2
  Top 0.152: U4.25 3.75,10.7 3.75,16.49 11.65,24.39 11.65,28.04 10.27,29.41 10.27,34.45 13.54,37.72 16.11,37.72 U0.65
A3
  Top 0.152: U4.26 3.25,10.07 3.25,16.42 11.34,24.52 11.34,27.91 9.97,29.28 9.97,34.58 13.41,38.02 16.51,38.02 U0.64
A4
  Top 0.152: U4.29 12.32,1 21.11,1 44.16,24.05 44.16,29.46 U0.144
A5
  Top 0.152: U4.30 12.95,1.5 21.18,1.5 43.86,24.18 43.86,29.06 U0.143
A6
  Top 0.152: U4.31 13.58,2 21.25,2 43.55,24.3 43.55,28.66 U0.142
A7
  Top 0.152: U4.32 14.21,2.5 21.31,2.5 43.25,24.44 43.25,28.25 U0.141
A8
  Top 0.152: U4.33 14.6,3.25 21.63,3.25 41.52,23.14 41.52,27.15 U0.137
A9
  Top 0.152: U4.34 15.23,3.75 21.7,3.75 41.22,23.27 41.22,26.75 U0.136
A10
  Top 0.152: U4.22 5.5,12.35 5.5,16.95 12.56,24.01 12.56,28.41 11.19,29.79 11.19,34.05 13.94,36.8 14.9,36.8 U0.68
A11
  Top 0.152: U4.35 15.86,4.25 21.77,4.25 40.91,23.4 40.91,26.35 U0.135
A12
  Top 0.152: U4.36 16.49,4.75 21.84,4.75 40.61,23.52 40.61,25.94 U0.134
ASDI
  Top 0.152: U6.5 44.75,39.75 44.5,39.5 43.49,39.5 43.48,39.5 43.29,39.5 41.75,37.96 41.75,37.61 41.06,36.93 41.02,36.93 U0.6
BA0
  Top 0.152: U4.20 6.75,13.36 6.75,17.34 13.17,23.76 13.17,28.67 11.8,30.04 11.8,33.8 13.42,35.42 14.16,35.42 U0.71
BA1
  Top 0.152: U4.21 6,12.98 6,17.02 12.87,23.88 12.87,28.54 11.49,29.91 11.49,33.92 14.07,36.5 14.5,36.5 U0.69
CAS  (1 unrouted)
  Top 0.152: U4.17 8.5,15 8.5,18.22 13.78,23.5 13.78,28.78 13.85,28.85 13.86,28.85 | 14.17,29.16 14.17,29.17 U0.76
CLK
  Top 0.152: U4.38 17.5,6 22.66,6 40.3,23.65 40.3,25.54 U0.133
CLK+  (via drill 0.3 pad 0.6)
  Top 0.152: J2.12 4.75,33.5 v5,33.75 | v17.75,40.25 19.02,38.98 U0.59
  Bottom 0.152: v5,33.75 5.97,34.72 5.98,34.72 6.29,35.03 6.29,35.05 13.5,42.25 15.75,42.25 v17.75,40.25
CLK-  (via drill 0.3 pad 0.6)
  Top 0.152: J2.13 5.01,33 v5.76,33.75 | v17.87,39.37 17.99,39.37 U0.60
  Bottom 0.152: v5.76,33.75 13.76,41.75 15.5,41.75 17.22,40.03 17.53,39.72 v17.87,39.38 v17.87,39.37
DATA
  Top 0.152: 42.95,45.3 U6.2 43.4,44.75 43.5,44.75 43.5,44.06 39.68,40.25 39.38,40.25 U0.13
DCLK
  Top 0.152: U0.12 39.79,39.94 39.81,39.94 42.12,42.25 44.1,42.25 U6.6
DQ0
  Top 0.152: U4.2 18.99,21.48 23.45,21.48 U0.100
DQ1
  Top 0.152: U4.4 18.85,19.36 24.16,19.36 U0.104
DQ2
  Top 0.152: U4.5 18.02,19.05 24.56,19.05 U0.105
DQ3
  Top 0.152: U4.7 16.07,18.75 24.96,18.75 U0.106
DQ4
  Top 0.152: U4.8 18.88,14.8 23.76,14.8 25.58,16.62 28.5,16.62 30.5,18.62 30.5,19.08 U0.110
DQ5
  Top 0.152: U4.10 16.92,14.5 23.88,14.5 25.7,16.32 28.64,16.32 30.95,18.63 30.95,19.34 U0.111
DQ6
  Top 0.152: U4.11 11.75,18.54 11.75,19.75 17.5,25.5 17.5,26.14 U0.85
DQ7
  Top 0.152: U4.13 10.75,17.28 10.75,19.18 15.95,24.38 15.95,26 U0.83
DQ8
  Top 0.152: U4.42 20.03,8 23.79,8 37.5,21.71 37.5,22.75 35.35,24.9 U0.125
DQ9
  Top 0.152: U4.44 20.79,9.5 24.86,9.5 35.61,20.25 35.61,21.75 U0.121
DQ10
  Top 0.152: U4.45 21.42,10 24.93,10 35.3,20.37 35.3,21.35 U0.120
DQ11
  Top 0.152: U4.47 22.68,11 25.5,11 35,20.5 35,21 33.22,22.78 U0.119
DQ12
  Top 0.152: U4.48 23.07,11.75 25.79,11.75 32.41,18.37 32.41,20.7 U0.115
DQ13
  Top 0.152: U4.50 24.33,12.75 26.36,12.75 32.11,18.5 32.11,20.3 U0.114
DQ14
  Top 0.152: U4.51 24.71,13.5 26.68,13.5 31.8,18.62 31.8,19.9 U0.113
DQ15
  Top 0.152: U4.53 25.97,14.5 27.25,14.5 31.5,18.75 31.5,19.5 U0.112
DQMH
  Top 0.152: U4.39 18.13,6.5 22.72,6.5 40,23.78 40,25.14 U0.132
DQML
  Top 0.152: U4.15 9.5,16.27 9.5,18.36 15.14,24 15.14,27.32 U0.80
GND  (via drill 0.3 pad 0.6)  (11 unrouted)
  other vias: 25.25,33 18.5,33.25 20.75,31 19.51,32.22 25,26.75 27.25,15.5 25.45,14.08 22.2,10.58 19.45,7.33 8.7,12.58 12.7,16.58 15.95,20.08 36.5,28.5 38,30 34.25,26.25 31,26.5 32.39,23.88 27,17.75 31.25,33 22.5,39.25 20.75,37.5 28.25,33
  pour Top: 0.12,55.87 0.12,0.12 77.74,0.12 77.74,55.87
  pour Bottom: 0.1,55.75 0.1,0.1 77.7,0.1 77.7,55.75
IN0+  (via drill 0.3 pad 0.6)
  Top 0.152: J2.21 5,29 v5.76,28.24 | v25.95,21.7 25.79,21.7 U0.103
  Bottom 0.152: v5.76,28.24 14.75,19.25 20.95,19.25 24.2,22.5 25.15,22.5 v25.95,21.7
IN0-  (via drill 0.3 pad 0.6)
  Top 0.152: J2.22 4.75,28.5 v5,28.25 | v23.5,20.95 23.62,20.95 U0.101
  Bottom 0.152: v5,28.25 14.5,18.75 21.29,18.75 v23.5,20.95
IN1+  (via drill 0.3 pad 0.6)
  Top 0.152: U0.99 25.01,23.76 v25.01,24.57 | J2.18 3.94,30.53 v5,30.53
  Bottom 0.152: v5,30.53 11.59,30.53 13.86,32.8 15.27,32.8 22.97,25.1 24.47,25.1 v25,24.57 v25.01,24.57
IN1-  (via drill 0.3 pad 0.6)
  Top 0.152: v24.25,24.57 24.25,23.7 U0.98 | J2.19 v5.75,30
  Bottom 0.152: v24.25,24.57 22.79,24.57 14.86,32.5 13.99,32.5 11.49,30 v5.75,30
IN2+  (via drill 0.3 pad 0.6)
  Top 0.152: J2.15 4.97,32 v5,32.03 | v20.8,28.02 U0.87
  Bottom 0.152: v5,32.03 12.23,32.03 13.61,33.41 15.52,33.41 19.75,29.19 20.39,29.19 20.8,28.78 v20.8,28.02
IN2-  (via drill 0.3 pad 0.6)
  Top 0.152: J2.16 v5.75,31.5 | v20.17,28.66 20.17,28.1 U0.86
  Bottom 0.152: v5.75,31.5 12.13,31.5 13.74,33.11 15.39,33.11 19.85,28.66 v20.17,28.66
IN3+  (via drill 0.3 pad 0.6)
  Top 0.152: J2.9 4.75,35 v5,35.25 | v20.75,43.75 22.27,42.23 U0.50
  Bottom 0.152: v5,35.25 14.75,45 19.5,45 v20.75,43.75
IN3-  (via drill 0.3 pad 0.6)
  Top 0.152: J2.10 5.01,34.5 v5.76,35.25 | v20.75,42.75 20.98,42.75 U0.51
  Bottom 0.152: v5.76,35.25 15.01,44.5 19,44.5 v20.75,42.75
LED_EN
  Top 0.254: J2.6 5.85,36.5 R2.1
N$1
  Top 0.254: U0.9 39.96,38 40.02,38 40.75,38.72 40.75,39.04 R4.1
N$2
  Top 0.305: U0.14 39.29,40.86 R3.1
N$3  (via drill 0.3 pad 0.6)
  Top 0.152: U0.20 34.61,40.42 v34.5,40.42
  Bottom 0.152: v34.5,40.42 34.29,40.63 34.29,41.71 29.05,46.95 28.14,46.95 27.82,47.28 27.82,48.18 22,54 5.75,54 4.5,52.75 4.5,50.54 J3.2
N$4  (via drill 0.3 pad 0.6)
  Top 0.152: U0.18 35.26,39.66 v34.75,39.66
  Bottom 0.152: v34.75,39.66 34.73,39.63 34.53,39.63 33.97,40.2 33.97,41.6 28.92,46.65 28.02,46.65 27.51,47.15 27.51,48.06 21.87,53.7 8,53.7 7.08,52.77 J3.3
N$5  (via drill 0.3 pad 0.6)
  Top 0.152: U0.16 35.84,38.82 v35.84,38.66
  Bottom 0.152: v35.84,38.66 34.99,38.66 33.66,39.99 33.66,41.48 28.8,46.34 27.89,46.34 27.21,47.03 27.21,47.93 21.75,53.39 10.14,53.39 9.5,52.75 9.5,50.62 J3.4
N$6
  Top 0.152: U0.23 38.76,46.69 U5.3
N$7  (via drill 0.3 pad 0.6)
  Top 0.152: U0.15 36.57,38.84 36.57,38.64 35.92,37.99 v35.46,37.99
  Bottom 0.152: v35.46,37.99 35.23,37.99 33.36,39.86 33.36,41.35 28.67,46.04 27.77,46.04 26.9,46.9 26.9,47.8 21.62,53.09 12.59,53.09 12.16,52.66 J3.5
N$8
  Top 0.152: 33,5.9 R5.1 33.02,5.9 D5.C
N$9  (1 unrouted)
N$10  (2 unrouted)
NCEO  (via drill 0.3 pad 0.6)
  Top 0.152: U6.1 43.8,46.2 44.68,45.32 v44.68,42.43 | v44,41.5 44,41.33 40.67,37.99 40.62,37.99 40.31,37.68 40.31,37.63 U0.8
  Bottom 0.152: v44,41.5 44.68,42.18 v44.68,42.43
RAS
  Top 0.152: U4.18 7.75,14.62 7.75,17.91 13.48,23.63 13.48,28.79 12.1,30.16 12.1,33.48 13.5,34.88 14,34.88 U0.72
SDCLK  (via drill 0.3 pad 0.6)
  Top 0.2: U0.28 33.53,45 v34.25,45
  Bottom 0.2: v34.25,45 35.66,45 48.96,31.7 SD1.5
SDCMD  (via drill 0.3 pad 0.6)
  Top 0.152: 39.75,39.34 v40,39.34
  Top 0.2: U0.11 39.18,38.62 39.18,38.77 39.75,39.34
  Bottom 0.2: v40,39.34 40.81,39.34 43.2,36.95 50.65,29.5 SD1.3
SDD0  (via drill 0.3 pad 0.6)
  Top 0.2: U0.30 33.12,46 v33.25,46
  Bottom 0.2: v33.25,46 35.17,46 47.23,33.94 63.09,33.94 SD1.7
SDD1  (via drill 0.3 pad 0.6)
  Top 0.2: v33.62,46.88 33.29,46.88 U0.31
  Bottom 0.2: SD1.8 63.03,35.1 46.59,35.1 34.81,46.88 v33.62,46.88
SDD2  (via drill 0.3 pad 0.6)
  Top 0.152: v40.84,37.46
  Top 0.2: U0.7 v40.84,37.46
  Bottom 0.2: v40.84,37.46 41.69,37.46 51.85,27.3 SD1.1
SDD3  (via drill 0.3 pad 0.6)
  Top 0.2: U0.10 39.78,38.52 v39.78,38.58
  Bottom 0.2: v39.78,38.58 41.07,38.58 51.25,28.4 SD1.2
UART_RX
  Top 0.152: U0.58 15.97,42.8 5.45,42.8 4.71,43.54 J1.2
UART_TX
  Top 0.152: U0.61 17.81,38.84 17.65,38.84 13.99,42.5 3,42.5 2.17,43.33 J1.3
VCC_PLL  (via drill 0.3 pad 0.6)
  Top 0.254: C45.1 10.03,36.1 L2.2 | U0.73 v14.18,31.93 12.84,33.28 v12.72,33.28
  Top 0.305: U0.1 42.7,33.68 C44.1 | U0.37 27.62,47.5 v28.35,47.5 | U0.109 28.78,18.4 C46.1
  Bottom 0.254: v12.72,33.28 C45.1 | C45.1
  Bottom 0.305: 28.35,18.5 C46.1 28.25,20.93 | C44.1 | v28.35,47.5 28.74,47.5 C43.1 29.38,47.53 42.93,33.98 C44.1 | 28.25,20.93 25.22,23.96 22.75,23.96 14.77,31.93 v14.18,31.93 | C44.1 42.93,33.08 30.78,20.93 28.25,20.93
  other vias: 42.93,33.68 28.25,18.4 10.03,35.97
VCCA  (via drill 0.3 pad 0.6)  (2 unrouted)
  Top 0.254: U0.35 31.25,47.67 31.25,48.5 C39.1 | 43.25,37.04 C40.1
  Top 0.305: v39.22,33.02 41.29,35.09 U0.3 43.1,36.9 | v28.62,45.19 28.77,45.19 U0.35 | v29.25,22.25 29.17,22.25 v27.58,20.67 U0.107 25.21,18.29 C41.1 | 43.1,36.9 43.25,37.04 | L1.2 43.1,36.87 43.1,36.9
  Bottom 0.305: v28.62,45.19 28.62,43.63 v39.22,33.03 v39.22,33.02 39.22,32.22 v29.25,22.25 | 15.75,30.25 22.5,23.5 25.03,23.5 27.58,20.95 v27.58,20.67
  other vias: 25.21,17.71
WE
  Top 0.152: U4.16 9,15.63 9,18.29 14.09,23.38 14.09,28.38 U0.77